# Altium schematic sheet LedsCounter.SchDoc: LiveDesign Evaluation - Countdown
size A4; Organization: Altium Limited; Address1: L3, 12a Rodborough Rd; Address2: Frenchs Forest; Address3: NSW; Address4: Australia 2086; DocumentNumber: 2; SheetNumber: 2; SheetTotal: 4
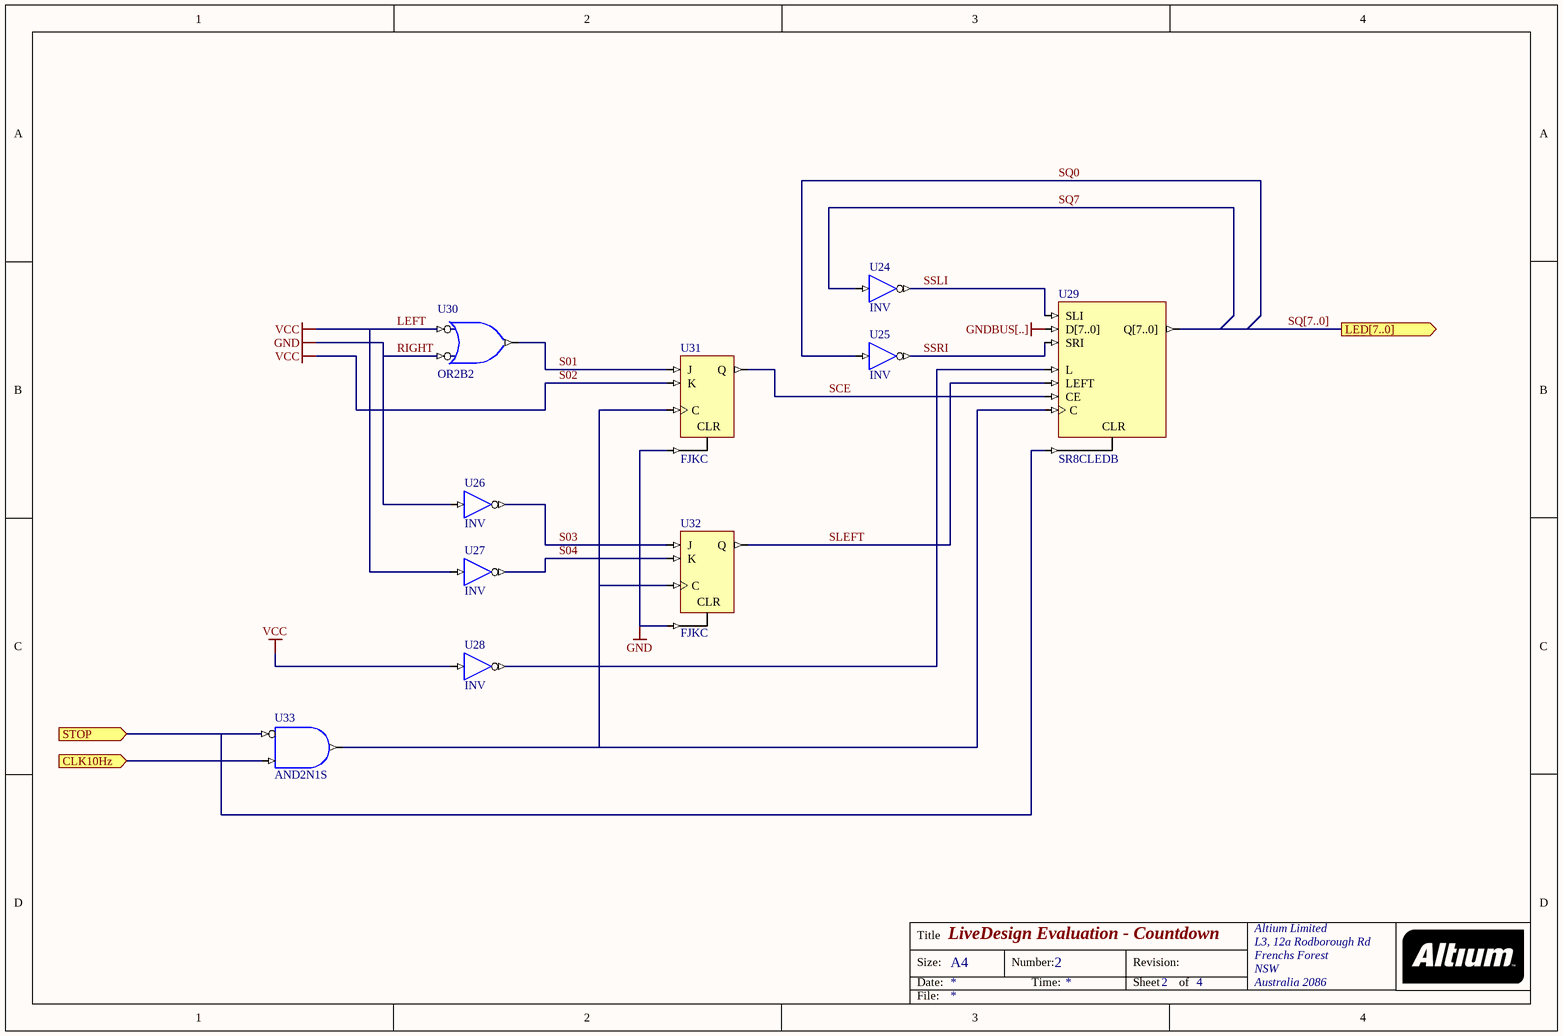
[diagram p0: LedsCounter.SchDoc]

## Parts
U24  INV
U25  INV
U26  INV
U27  INV
U28  INV
U29  SR8CLEDB
U30  OR2B2
U31  FJKC
U32  FJKC
U33  AND2N1S

## Ports
CLK10Hz (in), LED[7..0] (out), STOP (in)

## Nets
GNDBUS[..]: U29.D[7..0]
LEFT: U27.I U28.I U30.I0 U31.K  [also labelled S02, VCC]
RIGHT: U26.I U30.I1 U31.CLR U32.CLR  [also labelled GND]
CLK10Hz: U33.I1 ; port CLK10Hz
S01: U30.O U31.J
S03: U26.O U32.J
S04: U27.O U32.K
SCE: U29.CE U31.Q
SLEFT: U29.LEFT U32.Q
SQ0: U25.I
SQ7: U24.I
SQ[7..0]: U29.Q[7..0] ; port LED[7..0]
SSLI: U24.O U29.SLI
SSRI: U25.O U29.SRI
STOP: U29.CLR U33.I0 ; port STOP
NetU28_O: U28.O U29.L
NetU29_C: U29.C U31.C U32.C U33.O

## Buses and harness runs
bus SQ[7..0] = port LED[7..0]

## Notes on the sheet
- Title
- Size:
- Date:
- A4
- Number:
- Time:
- Revision:
- Sheet
- of
- File:

## Library data of the parts
U24-U28 = INV: Inverter; ArchiveName: GENERIC; Published: 9-30-2003; Publisher: Altium Limited; Xilinx Equivalent: INV; Core Revision: 1.00.00
U29 = SR8CLEDB: 8-Bit Shift Registers with Clock Enable and Asynchronous Clear, Bus Version; ArchiveName: GENERIC; Published: 9-30-2003; Publisher: Altium Limited; Xilinx Equivalent: SR8CLED; Core Revision: 1.00.00
U30 = OR2N2S: 2-Input OR Gate with Active Low A and B Inputs, Single Pin Version; ArchiveName: GENERIC; Published: 9-30-2003; Publisher: Altium Limited; Xilinx Equivalent: OR2B2; Core Revision: 1.00.00
U31 U32 = FJKC: J-K Flip-Flop with Asynchronous Clear; ArchiveName: GENERIC; Published: 9-30-2003; Publisher: Altium Limited; Xilinx Equivalent: FJKC; Core Revision: 1.00.00
U33 = AND2N1S: 2-Input AND Gate with Active Low A Input, Single Pin Version; XilinxEquivalent: AND2B1; FunctionalClass: Logic Primitive; PortSize: 2; ArchiveName: GENERIC; VHDLIB_SIM: GENERIC_LIB; Published: 29-Jan-2004; Publisher: Altium Limited; LastRevisionNo: 1.00.00; HelpURL: CR0118 FPGA Generic Library Guide.pdf#page=113; SubClass: AND; PortStyle: Single Pin Version